# EAGLE schematic 1u_mixer (EAGLE 6.6.0)
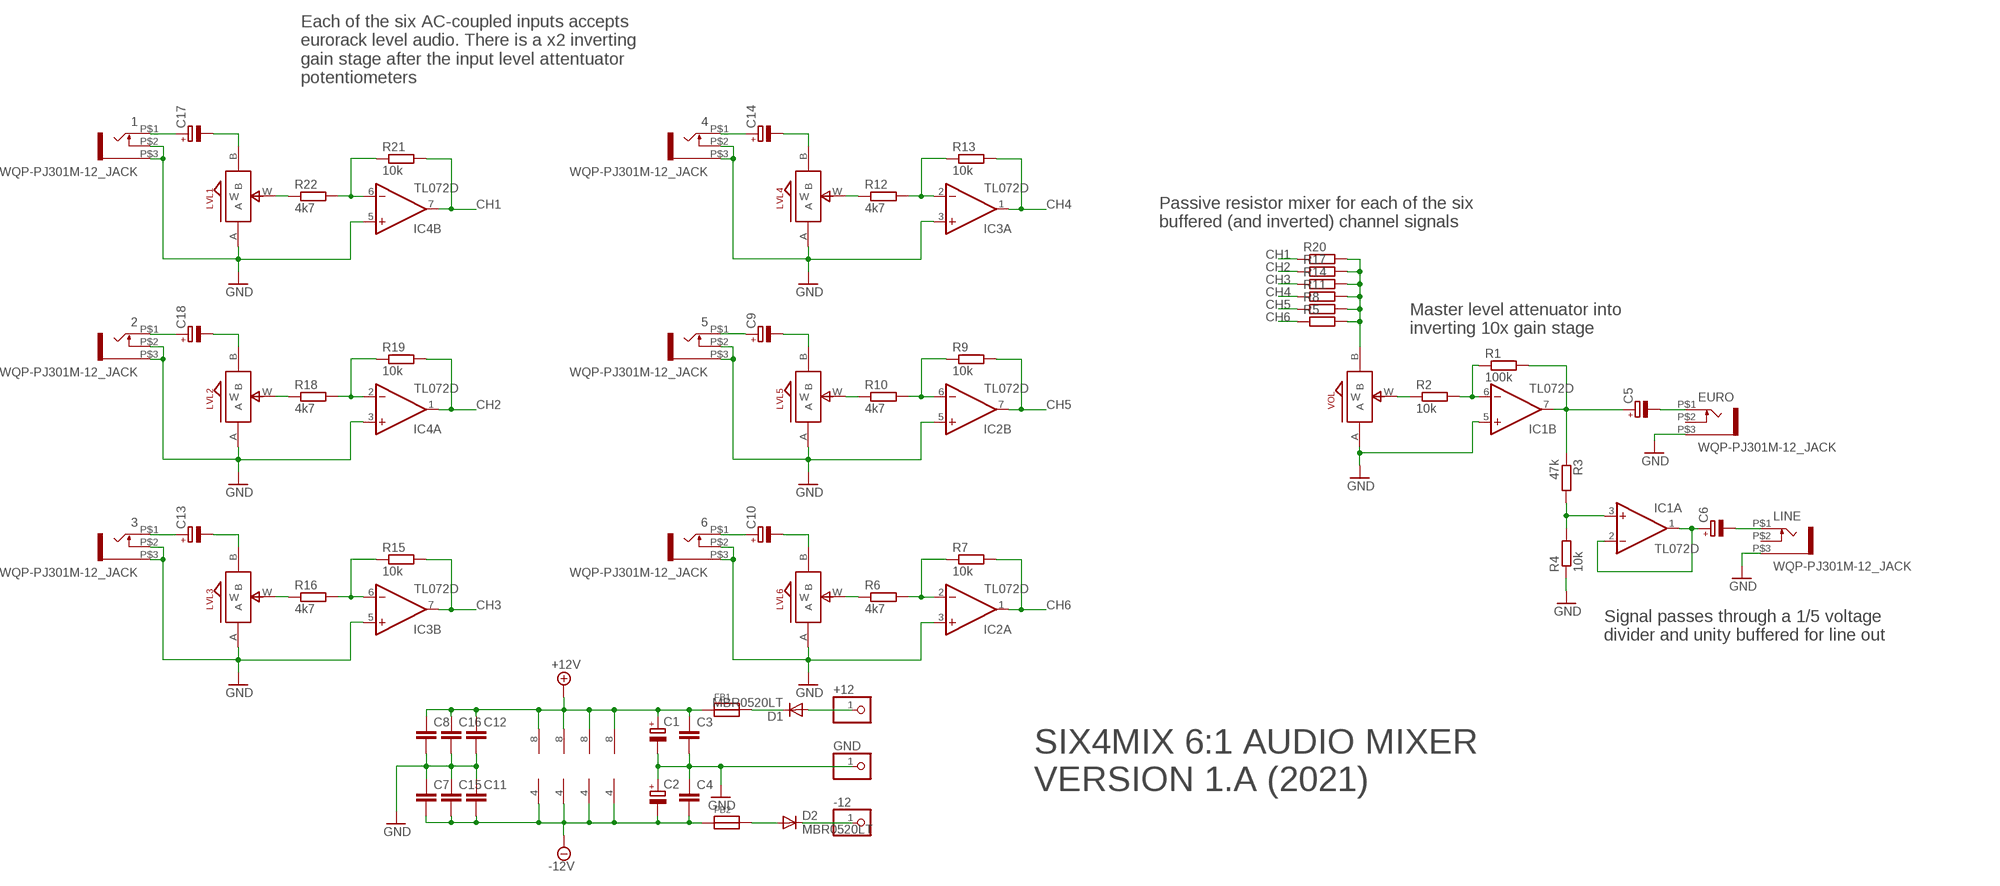
[diagram p0: schematic, sheet 1]

## Parts
1  WQP-PJ301M-12_JACK  [WQP-PJ301M-12_JACK]
2  WQP-PJ301M-12_JACK  [WQP-PJ301M-12_JACK]
3  WQP-PJ301M-12_JACK  [WQP-PJ301M-12_JACK]
4  WQP-PJ301M-12_JACK  [WQP-PJ301M-12_JACK]
5  WQP-PJ301M-12_JACK  [WQP-PJ301M-12_JACK]
6  WQP-PJ301M-12_JACK  [WQP-PJ301M-12_JACK]
+12  PINHD-1X1  [1X01]
-12  PINHD-1X1  [1X01]
C1  CPOL-EUE2-4  [E2-4]
C2  CPOL-EUE2-4  [E2-4]
C3  C-EUC0805  [C0805]
C4  C-EUC0805  [C0805]
C5  CPOL-EUE2-4  [E2-4]
C6  CPOL-EUE2-4  [E2-4]
C7  C-EUC0805  [C0805]
C8  C-EUC0805  [C0805]
C9  CPOL-EUE2-4  [E2-4]
C10  CPOL-EUE2-4  [E2-4]
C11  C-EUC0805  [C0805]
C12  C-EUC0805  [C0805]
C13  CPOL-EUE2-4  [E2-4]
C14  CPOL-EUE2-4  [E2-4]
C15  C-EUC0805  [C0805]
C16  C-EUC0805  [C0805]
C17  CPOL-EUE2-4  [E2-4]
C18  CPOL-EUE2-4  [E2-4]
D1  MBR0520LT  [SOD123]
D2  MBR0520LT  [SOD123]
EURO  WQP-PJ301M-12_JACK  [WQP-PJ301M-12_JACK]
FB1  FERRITE  [0603]
FB2  FERRITE  [0603]
GND  PINHD-1X1  [1X01]
IC1  TL072D  [SO08]
IC2  TL072D  [SO08]
IC3  TL072D  [SO08]
IC4  TL072D  [SO08]
LINE  WQP-PJ301M-12_JACK  [WQP-PJ301M-12_JACK]
LVL1  ALPS_POT_SMALL  [SMALL_ALPS_POT]
LVL2  ALPS_POT_SMALL  [SMALL_ALPS_POT]
LVL3  ALPS_POT_SMALL  [SMALL_ALPS_POT]
LVL4  ALPS_POT_SMALL  [SMALL_ALPS_POT]
LVL5  ALPS_POT_SMALL  [SMALL_ALPS_POT]
LVL6  ALPS_POT_SMALL  [SMALL_ALPS_POT]
R1  100k  R-EU_R0805  [R0805]
R2  10k  R-EU_R0805  [R0805]
R3  47k  R-EU_R0805  [R0805]
R4  10k  R-EU_R0805  [R0805]
R5  R-EU_R0805  [R0805]
R6  4k7  R-EU_R0805  [R0805]
R7  10k  R-EU_R0805  [R0805]
R8  R-EU_R0805  [R0805]
R9  10k  R-EU_R0805  [R0805]
R10  4k7  R-EU_R0805  [R0805]
R11  R-EU_R0805  [R0805]
R12  4k7  R-EU_R0805  [R0805]
R13  10k  R-EU_R0805  [R0805]
R14  R-EU_R0805  [R0805]
R15  10k  R-EU_R0805  [R0805]
R16  4k7  R-EU_R0805  [R0805]
R17  R-EU_R0805  [R0805]
R18  4k7  R-EU_R0805  [R0805]
R19  10k  R-EU_R0805  [R0805]
R20  R-EU_R0805  [R0805]
R21  10k  R-EU_R0805  [R0805]
R22  4k7  R-EU_R0805  [R0805]
VOL  ALPS_POT_SMALL  [SMALL_ALPS_POT]

## Nets
+12V: C1.+ C3.1 C8.1 C12.1 C16.1 FB1.1 IC1.8(P:V+) IC2.8(P:V+) IC3.8(P:V+) IC4.8(P:V+)
-12V: C2.- C4.2 C7.2 C11.2 C15.2 FB2.1 IC1.4(P:V-) IC2.4(P:V-) IC3.4(P:V-) IC4.4(P:V-)
CH1: IC4.7(B:OUT) R20.1 R21.2
CH2: IC4.1(A:OUT) R17.1 R19.2
CH3: IC3.7(B:OUT) R14.1 R15.2
CH4: IC3.1(A:OUT) R11.1 R13.2
CH5: IC2.7(B:OUT) R8.1 R9.2
CH6: IC2.1(A:OUT) R5.1 R7.2
GND: 1.P$2 1.P$3 2.P$2 2.P$3 3.P$2 3.P$3 4.P$2 4.P$3 5.P$2 5.P$3 6.P$2 6.P$3 C1.- C2.+ C3.2 C4.1 C7.1 C8.2 C11.1 C12.2 C15.1 C16.2 EURO.P$3 GND.1 IC1.5(B:+IN) IC2.3(A:+IN) IC2.5(B:+IN) IC3.3(A:+IN) IC3.5(B:+IN) IC4.3(A:+IN) IC4.5(B:+IN) LINE.P$3 LVL1.A LVL2.A LVL3.A LVL4.A LVL5.A LVL6.A R4.1 VOL.A
N$1: 5.P$1 C9.+
N$2: C9.- LVL5.B
N$3: IC2.6(B:-IN) R9.1 R10.2
N$4: LVL5.W R10.1
N$5: 6.P$1 C10.+
N$6: C10.- LVL6.B
N$7: IC2.2(A:-IN) R6.2 R7.1
N$8: LVL6.W R6.1
N$9: 3.P$1 C13.+
N$10: C13.- LVL3.B
N$11: IC3.6(B:-IN) R15.1 R16.2
N$12: LVL3.W R16.1
N$13: 4.P$1 C14.+
N$14: C14.- LVL4.B
N$15: IC3.2(A:-IN) R12.2 R13.1
N$16: LVL4.W R12.1
N$17: 1.P$1 C17.+
N$18: C17.- LVL1.B
N$19: IC4.6(B:-IN) R21.1 R22.2
N$20: LVL1.W R22.1
N$21: 2.P$1 C18.+
N$22: C18.- LVL2.B
N$23: IC4.2(A:-IN) R18.2 R19.1
N$24: LVL2.W R18.1
N$25: R5.2 R8.2 R11.2 R14.2 R17.2 R20.2 VOL.B
N$26: C5.- EURO.P$1
N$27: C6.- LINE.P$1
N$28: R2.1 VOL.W
N$29: IC1.6(B:-IN) R1.1 R2.2
N$30: C5.+ IC1.7(B:OUT) R1.2 R3.1
N$31: D1.C FB1.2
N$32: C6.+ IC1.1(A:OUT) IC1.2(A:-IN)
N$33: IC1.3(A:+IN) R3.2 R4.2
N$34: +12.1 D1.A
N$35: D2.A FB2.2
N$36: -12.1 D2.C
Unconnected: EURO.P$2 LINE.P$2

## Notes on the sheet
- Each of the six AC-coupled inputs accepts 
  eurorack level audio. There is a x2 inverting
  gain stage after the input level attentuator 
  potentiometers
- Passive resistor mixer for each of the six
  buffered (and inverted) channel signals
- Master level attenuator into 
  inverting 10x gain stage
- Signal passes through a 1/5 voltage 
  divider and unity buffered for line out
- SIX4MIX 6:1 AUDIO MIXER
  VERSION 1.A (2021)

## Library data of the parts
1-6 EURO LINE = thonkiconn:WQP-PJ301M-12_JACK
+12 -12 GND = pinhead:PINHD-1X1: PIN HEADER
C1 C2 C5 C6 C9 C10 C13 C14 C17 C18 = resistor:CPOL-EU: POLARIZED CAPACITOR, European symbol
C3 C4 C7 C8 C11 C12 C15 C16 = rcl:C-EU: CAPACITOR, European symbol
D1 D2 = diode:MBR0520LT: SCHOTTKY BARRIER RECTIFIER Source: http://onsemi.com .. MBR0520LT1-D.pdf
FB1 FB2 = microbuilder:FERRITE: Ferrite Bead 0603 MMZ1608B121C - 120 Ohm, 600mA Ferrite Chip - Digikey: 445-2164-1-ND BK1608HW121-T - 120 Ohm, 600mA Ferrite Chip - Digikey: 587-1876-2-ND
IC1-IC4 = linear:TL072: OP AMP
LVL1-LVL6 VOL = jasons_stuff:ALPS_POT_SMALL
R1-R22 = rcl:R-EU_: RESISTOR, European symbol